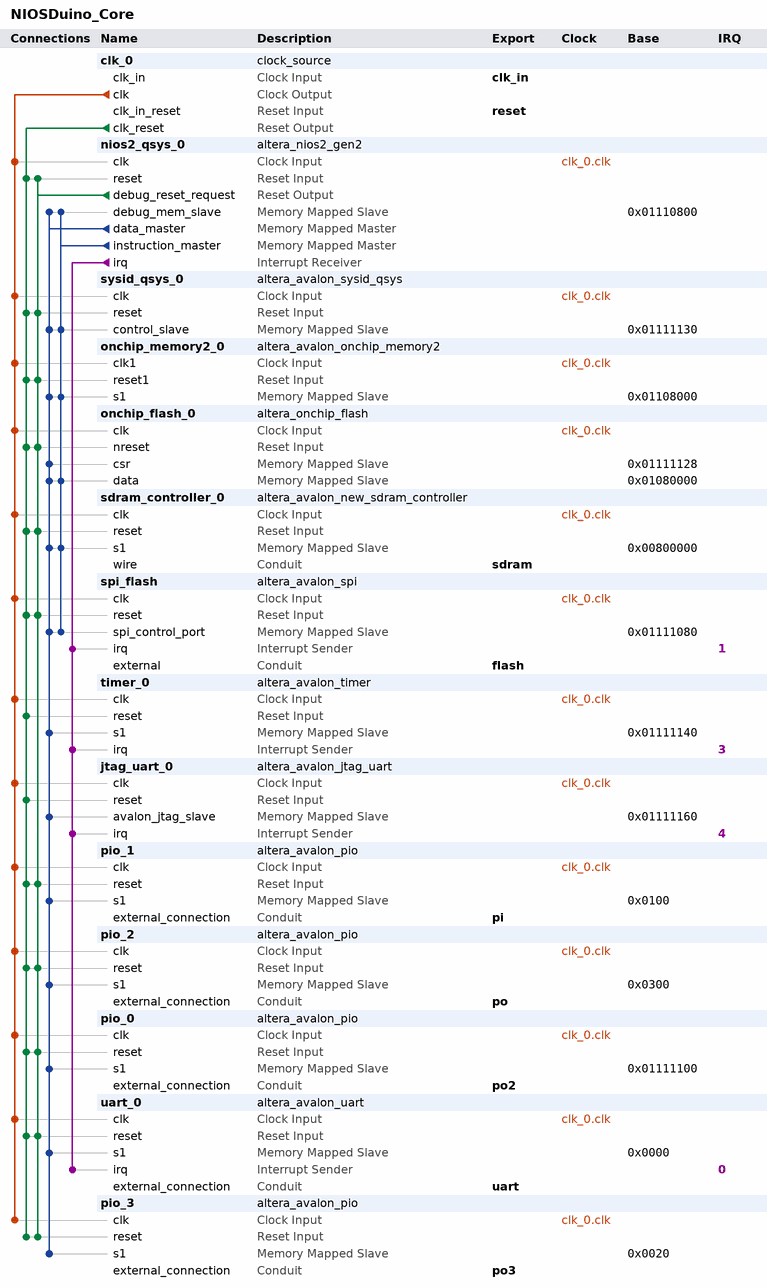
[diagram p0: system contents]
# Platform Designer (Qsys) system NIOSDuino_Core, MAX 10 10M08SAU169C8G
# Parameters at their usual value, and those the tool derives, are not listed.
package require -exact qsys 18.1
create_system NIOSDuino_Core
set_project_property DEVICE_FAMILY {MAX 10}
set_project_property DEVICE 10M08SAU169C8G

add_instance clk_0 clock_source 18.1
set_instance_parameter_value clk_0 clockFrequency 100000000

add_instance nios2_qsys_0 altera_nios2_gen2 18.1
set_instance_parameter_value nios2_qsys_0 dcache_size 2048
set_instance_parameter_value nios2_qsys_0 exceptionSlave onchip_memory2_0.s1
set_instance_parameter_value nios2_qsys_0 icache_size 4096
set_instance_parameter_value nios2_qsys_0 impl Tiny
set_instance_parameter_value nios2_qsys_0 resetSlave onchip_flash_0.data

add_instance sysid_qsys_0 altera_avalon_sysid_qsys 18.1
set_instance_parameter_value sysid_qsys_0 id 17149200

add_instance onchip_memory2_0 altera_avalon_onchip_memory2 18.1
set_instance_parameter_value onchip_memory2_0 dataWidth 32
set_instance_parameter_value onchip_memory2_0 dualPort false
set_instance_parameter_value onchip_memory2_0 initMemContent true
set_instance_parameter_value onchip_memory2_0 initializationFileName S:/Projekte/TEI0001/18.1/test_board/software/test_board/mem_init/NIOS_test_board_onchip_ram.hex
set_instance_parameter_value onchip_memory2_0 memorySize 32768
set_instance_parameter_value onchip_memory2_0 useNonDefaultInitFile true

add_instance onchip_flash_0 altera_onchip_flash 18.1
set_instance_parameter_value onchip_flash_0 CONFIGURATION_MODE {Single Uncompressed Image}
set_instance_parameter_value onchip_flash_0 SECTOR_ACCESS_MODE {Read and write,Read and write,Read and write,Read and write,Read and write}
set_instance_parameter_value onchip_flash_0 initFlashContent true
set_instance_parameter_value onchip_flash_0 initializationFileName altera_onchip_flash.hex
set_instance_parameter_value onchip_flash_0 useNonDefaultInitFile false

add_instance sdram_controller_0 altera_avalon_new_sdram_controller 18.1
set_instance_parameter_value sdram_controller_0 TAC 6.0
set_instance_parameter_value sdram_controller_0 TRCD 15.0
set_instance_parameter_value sdram_controller_0 TRFC 72.0
set_instance_parameter_value sdram_controller_0 TRP 15.0
set_instance_parameter_value sdram_controller_0 casLatency 2
set_instance_parameter_value sdram_controller_0 columnWidth 8
set_instance_parameter_value sdram_controller_0 dataWidth 16
set_instance_parameter_value sdram_controller_0 generateSimulationModel false
set_instance_parameter_value sdram_controller_0 model single_Micron_MT48LC4M32B2_7_chip
set_instance_parameter_value sdram_controller_0 numberOfBanks 4
set_instance_parameter_value sdram_controller_0 numberOfChipSelects 1
set_instance_parameter_value sdram_controller_0 powerUpDelay 200.0
set_instance_parameter_value sdram_controller_0 refreshPeriod 15.625
set_instance_parameter_value sdram_controller_0 rowWidth 12

add_instance spi_flash altera_avalon_spi 18.1
set_instance_parameter_value spi_flash clockPolarity 0
set_instance_parameter_value spi_flash dataWidth 8
set_instance_parameter_value spi_flash masterSPI true
set_instance_parameter_value spi_flash numberOfSlaves 1
set_instance_parameter_value spi_flash targetClockRate 25000000

add_instance timer_0 altera_avalon_timer 18.1
set_instance_parameter_value timer_0 period 1
set_instance_parameter_value timer_0 periodUnits MSEC

add_instance jtag_uart_0 altera_avalon_jtag_uart 18.1
set_instance_parameter_value jtag_uart_0 readBufferDepth 32
set_instance_parameter_value jtag_uart_0 simInteractiveOptions NO_INTERACTIVE_WINDOWS
set_instance_parameter_value jtag_uart_0 writeBufferDepth 128

add_instance pio_1 altera_avalon_pio 18.1
set_instance_parameter_value pio_1 direction Input
set_instance_parameter_value pio_1 width 32

add_instance pio_2 altera_avalon_pio 18.1
set_instance_parameter_value pio_2 bitModifyingOutReg true
set_instance_parameter_value pio_2 direction Output
set_instance_parameter_value pio_2 width 32

add_instance pio_0 altera_avalon_pio 18.1
set_instance_parameter_value pio_0 bitModifyingOutReg true
set_instance_parameter_value pio_0 direction Output
set_instance_parameter_value pio_0 width 32

add_instance uart_0 altera_avalon_uart 18.1
set_instance_parameter_value uart_0 baud 115200
set_instance_parameter_value uart_0 dataBits 8
set_instance_parameter_value uart_0 fixedBaud true
set_instance_parameter_value uart_0 parity NONE
set_instance_parameter_value uart_0 stopBits 1

add_instance pio_3 altera_avalon_pio 18.1
set_instance_parameter_value pio_3 bitModifyingOutReg true
set_instance_parameter_value pio_3 direction Output
set_instance_parameter_value pio_3 width 32

# connections
add_connection clk_0.clk jtag_uart_0.clk clock
add_connection clk_0.clk nios2_qsys_0.clk clock
add_connection clk_0.clk onchip_flash_0.clk clock
add_connection clk_0.clk onchip_memory2_0.clk1 clock
add_connection clk_0.clk pio_0.clk clock
add_connection clk_0.clk pio_1.clk clock
add_connection clk_0.clk pio_2.clk clock
add_connection clk_0.clk pio_3.clk clock
add_connection clk_0.clk sdram_controller_0.clk clock
add_connection clk_0.clk spi_flash.clk clock
add_connection clk_0.clk sysid_qsys_0.clk clock
add_connection clk_0.clk timer_0.clk clock
add_connection clk_0.clk uart_0.clk clock
add_connection clk_0.clk_reset jtag_uart_0.reset reset
add_connection clk_0.clk_reset nios2_qsys_0.reset reset
add_connection clk_0.clk_reset onchip_flash_0.nreset reset
add_connection clk_0.clk_reset onchip_memory2_0.reset1 reset
add_connection clk_0.clk_reset pio_0.reset reset
add_connection clk_0.clk_reset pio_1.reset reset
add_connection clk_0.clk_reset pio_2.reset reset
add_connection clk_0.clk_reset pio_3.reset reset
add_connection clk_0.clk_reset sdram_controller_0.reset reset
add_connection clk_0.clk_reset spi_flash.reset reset
add_connection clk_0.clk_reset sysid_qsys_0.reset reset
add_connection clk_0.clk_reset timer_0.reset reset
add_connection clk_0.clk_reset uart_0.reset reset
add_connection nios2_qsys_0.debug_reset_request nios2_qsys_0.reset reset
add_connection nios2_qsys_0.debug_reset_request onchip_flash_0.nreset reset
add_connection nios2_qsys_0.debug_reset_request onchip_memory2_0.reset1 reset
add_connection nios2_qsys_0.debug_reset_request pio_0.reset reset
add_connection nios2_qsys_0.debug_reset_request pio_1.reset reset
add_connection nios2_qsys_0.debug_reset_request pio_2.reset reset
add_connection nios2_qsys_0.debug_reset_request pio_3.reset reset
add_connection nios2_qsys_0.debug_reset_request sdram_controller_0.reset reset
add_connection nios2_qsys_0.debug_reset_request spi_flash.reset reset
add_connection nios2_qsys_0.debug_reset_request sysid_qsys_0.reset reset
add_connection nios2_qsys_0.debug_reset_request uart_0.reset reset
add_connection nios2_qsys_0.data_master jtag_uart_0.avalon_jtag_slave avalon
set_connection_parameter_value nios2_qsys_0.data_master/jtag_uart_0.avalon_jtag_slave baseAddress 0x01111160
add_connection nios2_qsys_0.data_master nios2_qsys_0.debug_mem_slave avalon
set_connection_parameter_value nios2_qsys_0.data_master/nios2_qsys_0.debug_mem_slave baseAddress 0x01110800
add_connection nios2_qsys_0.data_master onchip_flash_0.csr avalon
set_connection_parameter_value nios2_qsys_0.data_master/onchip_flash_0.csr baseAddress 0x01111128
add_connection nios2_qsys_0.data_master onchip_flash_0.data avalon
set_connection_parameter_value nios2_qsys_0.data_master/onchip_flash_0.data baseAddress 0x01080000
add_connection nios2_qsys_0.data_master onchip_memory2_0.s1 avalon
set_connection_parameter_value nios2_qsys_0.data_master/onchip_memory2_0.s1 baseAddress 0x01108000
add_connection nios2_qsys_0.data_master pio_0.s1 avalon
set_connection_parameter_value nios2_qsys_0.data_master/pio_0.s1 baseAddress 0x01111100
add_connection nios2_qsys_0.data_master pio_1.s1 avalon
set_connection_parameter_value nios2_qsys_0.data_master/pio_1.s1 baseAddress 0x0100
add_connection nios2_qsys_0.data_master pio_2.s1 avalon
set_connection_parameter_value nios2_qsys_0.data_master/pio_2.s1 baseAddress 0x0300
add_connection nios2_qsys_0.data_master pio_3.s1 avalon
set_connection_parameter_value nios2_qsys_0.data_master/pio_3.s1 baseAddress 0x0020
add_connection nios2_qsys_0.data_master sdram_controller_0.s1 avalon
set_connection_parameter_value nios2_qsys_0.data_master/sdram_controller_0.s1 baseAddress 0x00800000
add_connection nios2_qsys_0.data_master spi_flash.spi_control_port avalon
set_connection_parameter_value nios2_qsys_0.data_master/spi_flash.spi_control_port baseAddress 0x01111080
add_connection nios2_qsys_0.data_master sysid_qsys_0.control_slave avalon
set_connection_parameter_value nios2_qsys_0.data_master/sysid_qsys_0.control_slave baseAddress 0x01111130
add_connection nios2_qsys_0.data_master timer_0.s1 avalon
set_connection_parameter_value nios2_qsys_0.data_master/timer_0.s1 baseAddress 0x01111140
add_connection nios2_qsys_0.data_master uart_0.s1 avalon
set_connection_parameter_value nios2_qsys_0.data_master/uart_0.s1 baseAddress 0x0000
add_connection nios2_qsys_0.instruction_master nios2_qsys_0.debug_mem_slave avalon
set_connection_parameter_value nios2_qsys_0.instruction_master/nios2_qsys_0.debug_mem_slave baseAddress 0x01110800
add_connection nios2_qsys_0.instruction_master onchip_flash_0.data avalon
set_connection_parameter_value nios2_qsys_0.instruction_master/onchip_flash_0.data baseAddress 0x01080000
add_connection nios2_qsys_0.instruction_master onchip_memory2_0.s1 avalon
set_connection_parameter_value nios2_qsys_0.instruction_master/onchip_memory2_0.s1 baseAddress 0x01108000
add_connection nios2_qsys_0.instruction_master sdram_controller_0.s1 avalon
set_connection_parameter_value nios2_qsys_0.instruction_master/sdram_controller_0.s1 baseAddress 0x00800000
add_connection nios2_qsys_0.instruction_master spi_flash.spi_control_port avalon
set_connection_parameter_value nios2_qsys_0.instruction_master/spi_flash.spi_control_port baseAddress 0x01111080
add_connection nios2_qsys_0.instruction_master sysid_qsys_0.control_slave avalon
set_connection_parameter_value nios2_qsys_0.instruction_master/sysid_qsys_0.control_slave baseAddress 0x01111130
add_connection nios2_qsys_0.irq jtag_uart_0.irq interrupt
set_connection_parameter_value nios2_qsys_0.irq/jtag_uart_0.irq irqNumber 4
add_connection nios2_qsys_0.irq spi_flash.irq interrupt
set_connection_parameter_value nios2_qsys_0.irq/spi_flash.irq irqNumber 1
add_connection nios2_qsys_0.irq timer_0.irq interrupt
set_connection_parameter_value nios2_qsys_0.irq/timer_0.irq irqNumber 3
add_connection nios2_qsys_0.irq uart_0.irq interrupt
set_connection_parameter_value nios2_qsys_0.irq/uart_0.irq irqNumber 0

# exported interfaces
add_interface clk_in clock sink
set_interface_property clk_in EXPORT_OF clk_0.clk_in
add_interface flash conduit end
set_interface_property flash EXPORT_OF spi_flash.external
add_interface pi conduit end
set_interface_property pi EXPORT_OF pio_1.external_connection
add_interface po conduit end
set_interface_property po EXPORT_OF pio_2.external_connection
add_interface po2 conduit end
set_interface_property po2 EXPORT_OF pio_0.external_connection
add_interface po3 conduit end
set_interface_property po3 EXPORT_OF pio_3.external_connection
add_interface reset reset sink
set_interface_property reset EXPORT_OF clk_0.clk_in_reset
add_interface sdram conduit end
set_interface_property sdram EXPORT_OF sdram_controller_0.wire
add_interface uart conduit end
set_interface_property uart EXPORT_OF uart_0.external_connection

set_interconnect_requirement {$system} qsys_mm.clockCrossingAdapter HANDSHAKE
set_interconnect_requirement {$system} qsys_mm.enableEccProtection FALSE
set_interconnect_requirement {$system} qsys_mm.insertDefaultSlave FALSE
set_interconnect_requirement {$system} qsys_mm.maxAdditionalLatency 1

save_system NIOSDuino_Core.qsys
